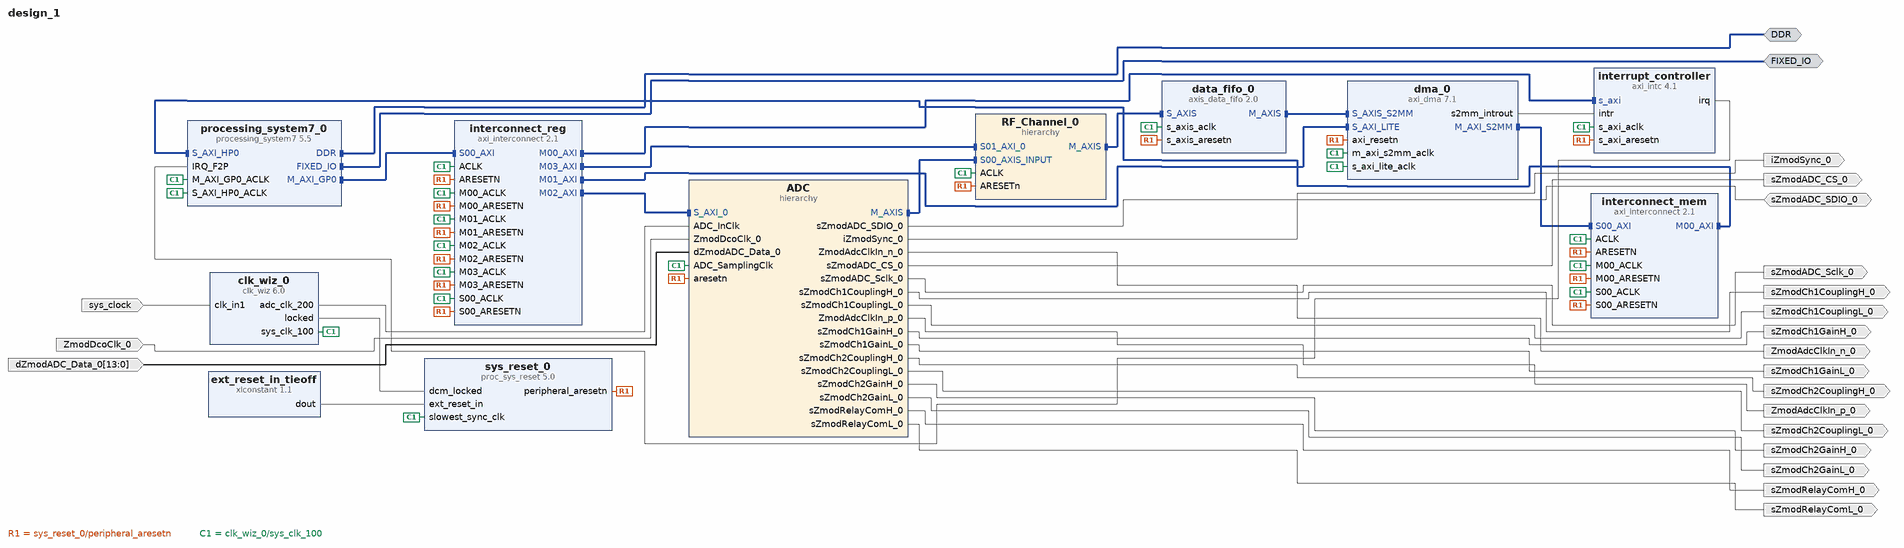
[diagram p0: block diagram of the top level]
# Vivado block design design_1, xc7z020clg484-1, Vivado 2023.1
create_bd_design design_1

create_bd_intf_port -mode Master -vlnv xilinx.com:interface:ddrx_rtl:1.0 DDR
create_bd_intf_port -mode Master -vlnv xilinx.com:display_processing_system7:fixedio_rtl:1.0 FIXED_IO
create_bd_port -dir O sZmodRelayComL_0
create_bd_port -dir O sZmodRelayComH_0
create_bd_port -dir O sZmodCh2GainL_0
create_bd_port -dir O sZmodCh2GainH_0
create_bd_port -dir O sZmodCh1GainL_0
create_bd_port -dir O sZmodCh1GainH_0
create_bd_port -dir O sZmodCh2CouplingL_0
create_bd_port -dir O sZmodCh2CouplingH_0
create_bd_port -dir O sZmodCh1CouplingL_0
create_bd_port -dir O sZmodCh1CouplingH_0
create_bd_port -dir O sZmodADC_Sclk_0
create_bd_port -dir O sZmodADC_CS_0
create_bd_port -dir IO sZmodADC_SDIO_0
create_bd_port -dir O iZmodSync_0
create_bd_port -dir O ZmodAdcClkIn_n_0
create_bd_port -dir O ZmodAdcClkIn_p_0
create_bd_port -dir I -from 13 -to 0 dZmodADC_Data_0
create_bd_port -dir I -type clk ZmodDcoClk_0
create_bd_port -dir I -type clk sys_clock
set_property -dict {CONFIG.FREQ_HZ 125000000 CONFIG.PHASE 0.0} [get_bd_ports sys_clock]

create_bd_cell -type ip -vlnv xilinx.com:ip:processing_system7:5.5 processing_system7_0
set_property -dict [list \
  CONFIG.PCW_APU_PERIPHERAL_FREQMHZ 666.666666 \
  CONFIG.PCW_ENET0_ENET0_IO {MIO 16 .. 27} \
  CONFIG.PCW_ENET0_GRP_MDIO_ENABLE 1 \
  CONFIG.PCW_ENET0_GRP_MDIO_IO {MIO 52 .. 53} \
  CONFIG.PCW_ENET0_PERIPHERAL_ENABLE 1 \
  CONFIG.PCW_ENET0_RESET_ENABLE 1 \
  CONFIG.PCW_ENET0_RESET_IO {MIO 9} \
  CONFIG.PCW_ENET_RESET_ENABLE 1 \
  CONFIG.PCW_ENET_RESET_SELECT {Share reset pin} \
  CONFIG.PCW_EN_CLK0_PORT 0 \
  CONFIG.PCW_FPGA0_PERIPHERAL_FREQMHZ 100 \
  CONFIG.PCW_FPGA1_PERIPHERAL_FREQMHZ 200 \
  CONFIG.PCW_GPIO_MIO_GPIO_ENABLE 1 \
  CONFIG.PCW_GPIO_MIO_GPIO_IO MIO \
  CONFIG.PCW_I2C1_I2C1_IO {MIO 12 .. 13} \
  CONFIG.PCW_I2C1_PERIPHERAL_ENABLE 1 \
  CONFIG.PCW_I2C_PERIPHERAL_FREQMHZ 111.111115 \
  CONFIG.PCW_I2C_RESET_ENABLE 1 \
  CONFIG.PCW_I2C_RESET_SELECT {Share reset pin} \
  CONFIG.PCW_IRQ_F2P_INTR 1 \
  CONFIG.PCW_PERIPHERAL_BOARD_PRESET part0 \
  CONFIG.PCW_PRESET_BANK1_VOLTAGE {LVCMOS 1.8V} \
  CONFIG.PCW_QSPI_GRP_FBCLK_ENABLE 1 \
  CONFIG.PCW_QSPI_GRP_FBCLK_IO {MIO 8} \
  CONFIG.PCW_QSPI_GRP_SINGLE_SS_ENABLE 1 \
  CONFIG.PCW_QSPI_GRP_SINGLE_SS_IO {MIO 1 .. 6} \
  CONFIG.PCW_QSPI_PERIPHERAL_ENABLE 1 \
  CONFIG.PCW_QSPI_QSPI_IO {MIO 1 .. 6} \
  CONFIG.PCW_SD0_GRP_CD_ENABLE 1 \
  CONFIG.PCW_SD0_GRP_CD_IO {MIO 47} \
  CONFIG.PCW_SD0_GRP_WP_ENABLE 0 \
  CONFIG.PCW_SD0_PERIPHERAL_ENABLE 1 \
  CONFIG.PCW_SD0_SD0_IO {MIO 40 .. 45} \
  CONFIG.PCW_SDIO_PERIPHERAL_FREQMHZ 50 \
  CONFIG.PCW_SINGLE_QSPI_DATA_MODE x4 \
  CONFIG.PCW_UART0_PERIPHERAL_ENABLE 1 \
  CONFIG.PCW_UART0_UART0_IO {MIO 14 .. 15} \
  CONFIG.PCW_UART1_PERIPHERAL_ENABLE 0 \
  CONFIG.PCW_UART_PERIPHERAL_FREQMHZ 100 \
  CONFIG.PCW_UIPARAM_DDR_FREQ_MHZ 533.333333 \
  CONFIG.PCW_UIPARAM_DDR_MEMORY_TYPE {DDR 3 (Low Voltage)} \
  CONFIG.PCW_UIPARAM_DDR_PARTNO {MT41K256M16 RE-125} \
  CONFIG.PCW_USB0_PERIPHERAL_ENABLE 1 \
  CONFIG.PCW_USB0_RESET_ENABLE 1 \
  CONFIG.PCW_USB0_RESET_IO {MIO 46} \
  CONFIG.PCW_USB0_USB0_IO {MIO 28 .. 39} \
  CONFIG.PCW_USB_RESET_ENABLE 1 \
  CONFIG.PCW_USB_RESET_SELECT {Share reset pin} \
  CONFIG.PCW_USE_FABRIC_INTERRUPT 1 \
  CONFIG.PCW_USE_S_AXI_HP0 1 \
  CONFIG.preset None \
] [get_bd_cells processing_system7_0]
# 512 more settings of processing_system7_0 are not shown: defaults, MIO pin electricals, DDR timing, and values the tool derives
create_bd_cell -type ip -vlnv xilinx.com:ip:clk_wiz:6.0 clk_wiz_0
set_property -dict [list \
  CONFIG.CLKOUT2_JITTER 109.241 \
  CONFIG.CLKOUT2_PHASE_ERROR 96.948 \
  CONFIG.CLKOUT2_REQUESTED_OUT_FREQ 200.000 \
  CONFIG.CLKOUT2_USED true \
  CONFIG.CLK_IN1_BOARD_INTERFACE sys_clock \
  CONFIG.CLK_OUT1_PORT sys_clk_100 \
  CONFIG.CLK_OUT2_PORT adc_clk_200 \
  CONFIG.MMCM_CLKOUT1_DIVIDE 5 \
  CONFIG.NUM_OUT_CLKS 2 \
  CONFIG.USE_BOARD_FLOW true \
] [get_bd_cells clk_wiz_0]
create_bd_cell -type ip -vlnv xilinx.com:ip:axi_interconnect:2.1 interconnect_reg
set_property -dict [list \
  CONFIG.ENABLE_ADVANCED_OPTIONS 1 \
  CONFIG.NUM_MI 4 \
  CONFIG.NUM_SI 1 \
  CONFIG.S00_HAS_REGSLICE 3 \
] [get_bd_cells interconnect_reg]
create_bd_cell -type ip -vlnv xilinx.com:ip:proc_sys_reset:5.0 sys_reset_0
set_property -dict {CONFIG.C_EXT_RST_WIDTH 1} [get_bd_cells sys_reset_0]
create_bd_cell -type ip -vlnv xilinx.com:ip:xlconstant:1.1 ext_reset_in_tieoff
create_bd_cell -type ip -vlnv xilinx.com:ip:axi_dma:7.1 dma_0
set_property -dict [list \
  CONFIG.c_include_mm2s 0 \
  CONFIG.c_include_s2mm 1 \
  CONFIG.c_include_sg 0 \
  CONFIG.c_m_axi_s2mm_data_width 64 \
] [get_bd_cells dma_0]
create_bd_cell -type ip -vlnv xilinx.com:ip:axi_interconnect:2.1 interconnect_mem
set_property -dict [list \
  CONFIG.ENABLE_ADVANCED_OPTIONS 1 \
  CONFIG.NUM_MI 1 \
  CONFIG.S00_HAS_REGSLICE 3 \
  CONFIG.XBAR_DATA_WIDTH 64 \
] [get_bd_cells interconnect_mem]
create_bd_cell -type ip -vlnv xilinx.com:ip:axis_data_fifo:2.0 data_fifo_0
set_property -dict [list \
  CONFIG.FIFO_DEPTH 512 \
  CONFIG.FIFO_MEMORY_TYPE auto \
  CONFIG.FIFO_MODE 2 \
  CONFIG.HAS_WR_DATA_COUNT 0 \
] [get_bd_cells data_fifo_0]
create_bd_cell -type ip -vlnv xilinx.com:ip:axi_intc:4.1 interrupt_controller
set_property -dict {CONFIG.C_IRQ_CONNECTION 1 CONFIG.C_KIND_OF_INTR 0xFFFFFFFF} [get_bd_cells interrupt_controller]
create_bd_cell -type hier RF_Channel_0
create_bd_cell -type hier ADC

# ---- hierarchy /RF_Channel_0 ----
current_bd_instance /RF_Channel_0
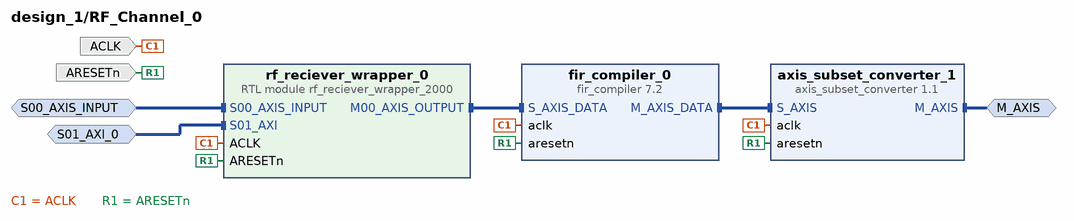
[diagram p1: block diagram inside /RF_Channel_0]
create_bd_intf_pin -mode Slave -vlnv xilinx.com:interface:axis_rtl:1.0 S00_AXIS_INPUT
create_bd_intf_pin -mode Master -vlnv xilinx.com:interface:axis_rtl:1.0 M_AXIS
create_bd_intf_pin -mode Slave -vlnv xilinx.com:interface:aximm_rtl:1.0 S01_AXI_0
create_bd_pin -dir I -type rst ARESETn
create_bd_pin -dir I -type clk ACLK

create_bd_cell -type ip -vlnv xilinx.com:ip:fir_compiler:7.2 fir_compiler_0
set_property -dict [list \
  CONFIG.BestPrecision false \
  CONFIG.Channel_Sequence Basic \
  CONFIG.Clock_Frequency 300.0 \
  CONFIG.CoefficientSource COE_File \
  CONFIG.Coefficient_File ../../../../../utils_1/fir_decimation_x16.coe \
  CONFIG.Coefficient_Fractional_Bits 0 \
  CONFIG.Coefficient_Reload false \
  CONFIG.Coefficient_Sets 1 \
  CONFIG.Coefficient_Sign Signed \
  CONFIG.Coefficient_Structure Inferred \
  CONFIG.Coefficient_Width 24 \
  CONFIG.ColumnConfig 1 \
  CONFIG.DATA_Has_TLAST Not_Required \
  CONFIG.Data_Fractional_Bits 0 \
  CONFIG.Data_Width 16 \
  CONFIG.Decimation_Rate 16 \
  CONFIG.Filter_Architecture Systolic_Multiply_Accumulate \
  CONFIG.Filter_Selection 1 \
  CONFIG.Filter_Type Decimation \
  CONFIG.Has_ARESETn true \
  CONFIG.Interpolation_Rate 1 \
  CONFIG.M_DATA_Has_TUSER Not_Required \
  CONFIG.Number_Channels 1 \
  CONFIG.Number_Paths 2 \
  CONFIG.Output_Rounding_Mode Truncate_LSBs \
  CONFIG.Output_Width 17 \
  CONFIG.Passband_Max 0.35 \
  CONFIG.Quantization Integer_Coefficients \
  CONFIG.RateSpecification Input_Sample_Period \
  CONFIG.S_DATA_Has_FIFO false \
  CONFIG.S_DATA_Has_TUSER Not_Required \
  CONFIG.SamplePeriod 32 \
  CONFIG.Sample_Frequency 0.001 \
  CONFIG.Select_Pattern All \
  CONFIG.Zero_Pack_Factor 1 \
] [get_bd_cells fir_compiler_0]
create_bd_cell -type ip -vlnv xilinx.com:ip:axis_subset_converter:1.1 axis_subset_converter_1
set_property -dict [list \
  CONFIG.DEFAULT_TLAST 256 \
  CONFIG.M_HAS_TLAST 1 \
  CONFIG.M_TDATA_NUM_BYTES 4 \
  CONFIG.TDATA_REMAP {tdata[39:24], tdata[15:0]} \
] [get_bd_cells axis_subset_converter_1]
create_bd_cell -type module -reference rf_reciever_wrapper_2000 rf_reciever_wrapper_0
set_property -dict [list \
  CONFIG.G_CIC_DECIMATION 32 \
  CONFIG.G_CIC_ORDER 8 \
  CONFIG.G_HAS_SECOND_OUTPUT true \
  CONFIG.G_S01_AXI_ADDR_WIDTH 8 \
] [get_bd_cells rf_reciever_wrapper_0]

# ---- hierarchy /ADC ----
current_bd_instance /ADC
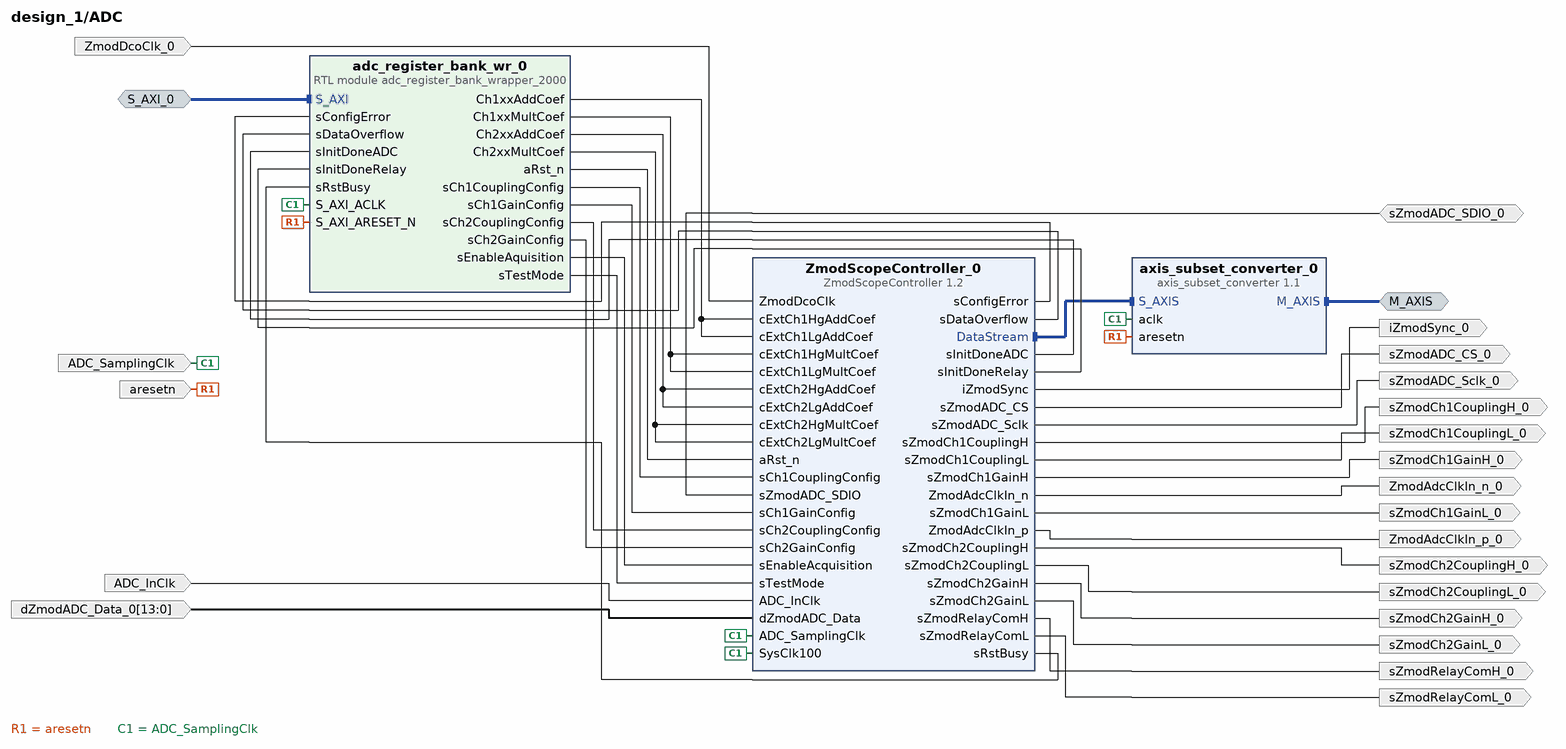
[diagram p2: block diagram inside /ADC]
create_bd_intf_pin -mode Master -vlnv xilinx.com:interface:axis_rtl:1.0 M_AXIS
create_bd_intf_pin -mode Slave -vlnv xilinx.com:interface:aximm_rtl:1.0 S_AXI_0
create_bd_pin -dir I -type clk ADC_SamplingClk
create_bd_pin -dir I -type clk ADC_InClk
create_bd_pin -dir I -type rst aresetn
create_bd_pin -dir O ZmodAdcClkIn_p_0
create_bd_pin -dir O ZmodAdcClkIn_n_0
create_bd_pin -dir O iZmodSync_0
create_bd_pin -dir I -type clk ZmodDcoClk_0
create_bd_pin -dir I -from 13 -to 0 dZmodADC_Data_0
create_bd_pin -dir IO sZmodADC_SDIO_0
create_bd_pin -dir O sZmodADC_CS_0
create_bd_pin -dir O sZmodADC_Sclk_0
create_bd_pin -dir O sZmodCh1CouplingH_0
create_bd_pin -dir O sZmodCh1CouplingL_0
create_bd_pin -dir O sZmodCh2CouplingH_0
create_bd_pin -dir O sZmodCh2CouplingL_0
create_bd_pin -dir O sZmodCh1GainH_0
create_bd_pin -dir O sZmodCh1GainL_0
create_bd_pin -dir O sZmodCh2GainH_0
create_bd_pin -dir O sZmodCh2GainL_0
create_bd_pin -dir O sZmodRelayComH_0
create_bd_pin -dir O sZmodRelayComL_0

create_bd_cell -type ip -vlnv digilent.com:user:ZmodScopeController:1.2 ZmodScopeController_0
set_property -dict [list \
  CONFIG.kADC_ClkDiv 2 \
  CONFIG.kCh1CouplingStatic {"1"} \
  CONFIG.kCh1GainStatic {"1"} \
  CONFIG.kCh2CouplingStatic {"1"} \
  CONFIG.kCh2GainStatic {"1"} \
  CONFIG.kExtCalibEn true \
  CONFIG.kExtRelayConfigEn true \
  CONFIG.kExtSyncEn false \
] [get_bd_cells ZmodScopeController_0]
create_bd_cell -type ip -vlnv xilinx.com:ip:axis_subset_converter:1.1 axis_subset_converter_0
set_property -dict {CONFIG.M_TDATA_NUM_BYTES 2 CONFIG.TDATA_REMAP {tdata[31:16]}} [get_bd_cells axis_subset_converter_0]
create_bd_cell -type module -reference adc_register_bank_wrapper_2000 adc_register_bank_wr_0

# ---- connections ----

current_bd_instance /RF_Channel_0
connect_bd_intf_net [get_bd_intf_pins rf_reciever_wrapper_0/S00_AXIS_INPUT] [get_bd_intf_pins S00_AXIS_INPUT]
connect_bd_intf_net [get_bd_intf_pins axis_subset_converter_1/M_AXIS] [get_bd_intf_pins M_AXIS]
connect_bd_intf_net [get_bd_intf_pins rf_reciever_wrapper_0/S01_AXI] [get_bd_intf_pins S01_AXI_0]
connect_bd_intf_net [get_bd_intf_pins fir_compiler_0/M_AXIS_DATA] [get_bd_intf_pins axis_subset_converter_1/S_AXIS]
connect_bd_intf_net [get_bd_intf_pins fir_compiler_0/S_AXIS_DATA] [get_bd_intf_pins rf_reciever_wrapper_0/M00_AXIS_OUTPUT]
connect_bd_net [get_bd_pins ACLK] \
  [get_bd_pins axis_subset_converter_1/aclk] [get_bd_pins fir_compiler_0/aclk] [get_bd_pins rf_reciever_wrapper_0/ACLK]
connect_bd_net [get_bd_pins ARESETn] \
  [get_bd_pins axis_subset_converter_1/aresetn] [get_bd_pins fir_compiler_0/aresetn] \
  [get_bd_pins rf_reciever_wrapper_0/ARESETn]

current_bd_instance /ADC
connect_bd_intf_net [get_bd_intf_pins adc_register_bank_wr_0/S_AXI] [get_bd_intf_pins S_AXI_0]
connect_bd_intf_net [get_bd_intf_pins ZmodScopeController_0/DataStream] [get_bd_intf_pins axis_subset_converter_0/S_AXIS]
connect_bd_intf_net [get_bd_intf_pins M_AXIS] [get_bd_intf_pins axis_subset_converter_0/M_AXIS]
connect_bd_net [get_bd_pins sZmodADC_SDIO_0] [get_bd_pins ZmodScopeController_0/sZmodADC_SDIO]
connect_bd_net -net ZmodDcoClk_0_1 [get_bd_pins ZmodDcoClk_0] [get_bd_pins ZmodScopeController_0/ZmodDcoClk]
connect_bd_net [get_bd_pins ZmodScopeController_0/ZmodAdcClkIn_n] [get_bd_pins ZmodAdcClkIn_n_0]
connect_bd_net [get_bd_pins ZmodScopeController_0/ZmodAdcClkIn_p] [get_bd_pins ZmodAdcClkIn_p_0]
connect_bd_net [get_bd_pins ZmodScopeController_0/iZmodSync] [get_bd_pins iZmodSync_0]
connect_bd_net [get_bd_pins ZmodScopeController_0/sConfigError] [get_bd_pins adc_register_bank_wr_0/sConfigError]
connect_bd_net [get_bd_pins ZmodScopeController_0/sDataOverflow] [get_bd_pins adc_register_bank_wr_0/sDataOverflow]
connect_bd_net [get_bd_pins ZmodScopeController_0/sInitDoneADC] [get_bd_pins adc_register_bank_wr_0/sInitDoneADC]
connect_bd_net [get_bd_pins ZmodScopeController_0/sInitDoneRelay] [get_bd_pins adc_register_bank_wr_0/sInitDoneRelay]
connect_bd_net [get_bd_pins ZmodScopeController_0/sRstBusy] [get_bd_pins adc_register_bank_wr_0/sRstBusy]
connect_bd_net [get_bd_pins ZmodScopeController_0/sZmodADC_CS] [get_bd_pins sZmodADC_CS_0]
connect_bd_net [get_bd_pins ZmodScopeController_0/sZmodADC_Sclk] [get_bd_pins sZmodADC_Sclk_0]
connect_bd_net [get_bd_pins ZmodScopeController_0/sZmodCh1CouplingH] [get_bd_pins sZmodCh1CouplingH_0]
connect_bd_net [get_bd_pins ZmodScopeController_0/sZmodCh1CouplingL] [get_bd_pins sZmodCh1CouplingL_0]
connect_bd_net [get_bd_pins ZmodScopeController_0/sZmodCh1GainH] [get_bd_pins sZmodCh1GainH_0]
connect_bd_net [get_bd_pins ZmodScopeController_0/sZmodCh1GainL] [get_bd_pins sZmodCh1GainL_0]
connect_bd_net [get_bd_pins ZmodScopeController_0/sZmodCh2CouplingH] [get_bd_pins sZmodCh2CouplingH_0]
connect_bd_net [get_bd_pins ZmodScopeController_0/sZmodCh2CouplingL] [get_bd_pins sZmodCh2CouplingL_0]
connect_bd_net [get_bd_pins ZmodScopeController_0/sZmodCh2GainH] [get_bd_pins sZmodCh2GainH_0]
connect_bd_net [get_bd_pins ZmodScopeController_0/sZmodCh2GainL] [get_bd_pins sZmodCh2GainL_0]
connect_bd_net [get_bd_pins ZmodScopeController_0/sZmodRelayComH] [get_bd_pins sZmodRelayComH_0]
connect_bd_net [get_bd_pins ZmodScopeController_0/sZmodRelayComL] [get_bd_pins sZmodRelayComL_0]
connect_bd_net [get_bd_pins adc_register_bank_wr_0/Ch1xxAddCoef] \
  [get_bd_pins ZmodScopeController_0/cExtCh1LgAddCoef] [get_bd_pins ZmodScopeController_0/cExtCh1HgAddCoef]
connect_bd_net [get_bd_pins adc_register_bank_wr_0/Ch1xxMultCoef] \
  [get_bd_pins ZmodScopeController_0/cExtCh1HgMultCoef] [get_bd_pins ZmodScopeController_0/cExtCh1LgMultCoef]
connect_bd_net [get_bd_pins adc_register_bank_wr_0/Ch2xxAddCoef] \
  [get_bd_pins ZmodScopeController_0/cExtCh2LgAddCoef] [get_bd_pins ZmodScopeController_0/cExtCh2HgAddCoef]
connect_bd_net [get_bd_pins adc_register_bank_wr_0/Ch2xxMultCoef] \
  [get_bd_pins ZmodScopeController_0/cExtCh2HgMultCoef] [get_bd_pins ZmodScopeController_0/cExtCh2LgMultCoef]
connect_bd_net [get_bd_pins adc_register_bank_wr_0/aRst_n] [get_bd_pins ZmodScopeController_0/aRst_n]
connect_bd_net [get_bd_pins adc_register_bank_wr_0/sCh1CouplingConfig] [get_bd_pins ZmodScopeController_0/sCh1CouplingConfig]
connect_bd_net [get_bd_pins adc_register_bank_wr_0/sCh1GainConfig] [get_bd_pins ZmodScopeController_0/sCh1GainConfig]
connect_bd_net [get_bd_pins adc_register_bank_wr_0/sCh2CouplingConfig] [get_bd_pins ZmodScopeController_0/sCh2CouplingConfig]
connect_bd_net [get_bd_pins adc_register_bank_wr_0/sCh2GainConfig] [get_bd_pins ZmodScopeController_0/sCh2GainConfig]
connect_bd_net [get_bd_pins adc_register_bank_wr_0/sEnableAquisition] [get_bd_pins ZmodScopeController_0/sEnableAcquisition]
connect_bd_net [get_bd_pins adc_register_bank_wr_0/sTestMode] [get_bd_pins ZmodScopeController_0/sTestMode]
connect_bd_net -net clk_wiz_0_adc_clk_200 [get_bd_pins ADC_InClk] [get_bd_pins ZmodScopeController_0/ADC_InClk]
connect_bd_net -net clk_wiz_0_locked [get_bd_pins aresetn] \
  [get_bd_pins axis_subset_converter_0/aresetn] [get_bd_pins adc_register_bank_wr_0/S_AXI_ARESET_N]
connect_bd_net -net clk_wiz_0_sys_clk_100 [get_bd_pins ADC_SamplingClk] \
  [get_bd_pins ZmodScopeController_0/ADC_SamplingClk] [get_bd_pins axis_subset_converter_0/aclk] \
  [get_bd_pins ZmodScopeController_0/SysClk100] [get_bd_pins adc_register_bank_wr_0/S_AXI_ACLK]
connect_bd_net -net dZmodADC_Data_0_1 [get_bd_pins dZmodADC_Data_0] [get_bd_pins ZmodScopeController_0/dZmodADC_Data]

current_bd_instance /
connect_bd_intf_net [get_bd_intf_pins data_fifo_0/S_AXIS] [get_bd_intf_pins RF_Channel_0/M_AXIS]
connect_bd_intf_net [get_bd_intf_pins interconnect_reg/S00_AXI] [get_bd_intf_pins processing_system7_0/M_AXI_GP0]
connect_bd_intf_net -intf_net S_AXI_0_1 [get_bd_intf_pins ADC/S_AXI_0] [get_bd_intf_pins interconnect_reg/M02_AXI]
connect_bd_intf_net -intf_net axi_dma_0_M_AXI_S2MM [get_bd_intf_pins dma_0/M_AXI_S2MM] [get_bd_intf_pins interconnect_mem/S00_AXI]
connect_bd_intf_net -intf_net axi_interconnect_1_M00_AXI [get_bd_intf_pins interconnect_mem/M00_AXI] [get_bd_intf_pins processing_system7_0/S_AXI_HP0]
connect_bd_intf_net -intf_net axis_data_fifo_0_M_AXIS [get_bd_intf_pins data_fifo_0/M_AXIS] [get_bd_intf_pins dma_0/S_AXIS_S2MM]
connect_bd_intf_net -intf_net axis_subset_converter_0_M_AXIS [get_bd_intf_pins ADC/M_AXIS] [get_bd_intf_pins RF_Channel_0/S00_AXIS_INPUT]
connect_bd_intf_net [get_bd_intf_pins interrupt_controller/s_axi] [get_bd_intf_pins interconnect_reg/M00_AXI]
connect_bd_intf_net [get_bd_intf_pins interconnect_reg/M01_AXI] [get_bd_intf_pins dma_0/S_AXI_LITE]
connect_bd_intf_net [get_bd_intf_pins interconnect_reg/M03_AXI] [get_bd_intf_pins RF_Channel_0/S01_AXI_0]
connect_bd_intf_net [get_bd_intf_ports DDR] [get_bd_intf_pins processing_system7_0/DDR]
connect_bd_intf_net [get_bd_intf_ports FIXED_IO] [get_bd_intf_pins processing_system7_0/FIXED_IO]
connect_bd_net [get_bd_ports sZmodADC_SDIO_0] [get_bd_pins ADC/sZmodADC_SDIO_0]
connect_bd_net -net ZmodDcoClk_0_1 [get_bd_ports ZmodDcoClk_0] [get_bd_pins ADC/ZmodDcoClk_0]
connect_bd_net -net ZmodScopeController_0_ZmodAdcClkIn_n [get_bd_pins ADC/ZmodAdcClkIn_n_0] [get_bd_ports ZmodAdcClkIn_n_0]
connect_bd_net -net ZmodScopeController_0_ZmodAdcClkIn_p [get_bd_pins ADC/ZmodAdcClkIn_p_0] [get_bd_ports ZmodAdcClkIn_p_0]
connect_bd_net -net ZmodScopeController_0_iZmodSync [get_bd_pins ADC/iZmodSync_0] [get_bd_ports iZmodSync_0]
connect_bd_net -net ZmodScopeController_0_sZmodADC_CS [get_bd_pins ADC/sZmodADC_CS_0] [get_bd_ports sZmodADC_CS_0]
connect_bd_net -net ZmodScopeController_0_sZmodADC_Sclk [get_bd_pins ADC/sZmodADC_Sclk_0] [get_bd_ports sZmodADC_Sclk_0]
connect_bd_net -net ZmodScopeController_0_sZmodCh1CouplingH [get_bd_pins ADC/sZmodCh1CouplingH_0] [get_bd_ports sZmodCh1CouplingH_0]
connect_bd_net -net ZmodScopeController_0_sZmodCh1CouplingL [get_bd_pins ADC/sZmodCh1CouplingL_0] [get_bd_ports sZmodCh1CouplingL_0]
connect_bd_net -net ZmodScopeController_0_sZmodCh1GainH [get_bd_pins ADC/sZmodCh1GainH_0] [get_bd_ports sZmodCh1GainH_0]
connect_bd_net -net ZmodScopeController_0_sZmodCh1GainL [get_bd_pins ADC/sZmodCh1GainL_0] [get_bd_ports sZmodCh1GainL_0]
connect_bd_net -net ZmodScopeController_0_sZmodCh2CouplingH [get_bd_pins ADC/sZmodCh2CouplingH_0] [get_bd_ports sZmodCh2CouplingH_0]
connect_bd_net -net ZmodScopeController_0_sZmodCh2CouplingL [get_bd_pins ADC/sZmodCh2CouplingL_0] [get_bd_ports sZmodCh2CouplingL_0]
connect_bd_net -net ZmodScopeController_0_sZmodCh2GainH [get_bd_pins ADC/sZmodCh2GainH_0] [get_bd_ports sZmodCh2GainH_0]
connect_bd_net -net ZmodScopeController_0_sZmodCh2GainL [get_bd_pins ADC/sZmodCh2GainL_0] [get_bd_ports sZmodCh2GainL_0]
connect_bd_net -net ZmodScopeController_0_sZmodRelayComH [get_bd_pins ADC/sZmodRelayComH_0] [get_bd_ports sZmodRelayComH_0]
connect_bd_net -net ZmodScopeController_0_sZmodRelayComL [get_bd_pins ADC/sZmodRelayComL_0] [get_bd_ports sZmodRelayComL_0]
connect_bd_net [get_bd_pins clk_wiz_0/adc_clk_200] [get_bd_pins ADC/ADC_InClk]
connect_bd_net -net clk_wiz_0_locked [get_bd_pins sys_reset_0/peripheral_aresetn] \
  [get_bd_pins interconnect_reg/M00_ARESETN] [get_bd_pins dma_0/axi_resetn] [get_bd_pins interconnect_mem/M00_ARESETN] \
  [get_bd_pins interconnect_mem/S00_ARESETN] [get_bd_pins interconnect_mem/ARESETN] \
  [get_bd_pins interconnect_reg/S00_ARESETN] [get_bd_pins interconnect_reg/ARESETN] [get_bd_pins data_fifo_0/s_axis_aresetn] \
  [get_bd_pins interconnect_reg/M01_ARESETN] [get_bd_pins interrupt_controller/s_axi_aresetn] \
  [get_bd_pins RF_Channel_0/ARESETn] [get_bd_pins ADC/aresetn] [get_bd_pins interconnect_reg/M02_ARESETN] \
  [get_bd_pins interconnect_reg/M03_ARESETN]
connect_bd_net [get_bd_pins clk_wiz_0/locked] [get_bd_pins sys_reset_0/dcm_locked]
connect_bd_net [get_bd_pins clk_wiz_0/sys_clk_100] \
  [get_bd_pins interconnect_reg/M00_ACLK] [get_bd_pins sys_reset_0/slowest_sync_clk] [get_bd_pins dma_0/m_axi_s2mm_aclk] \
  [get_bd_pins dma_0/s_axi_lite_aclk] [get_bd_pins interconnect_mem/ACLK] [get_bd_pins interconnect_mem/M00_ACLK] \
  [get_bd_pins interconnect_mem/S00_ACLK] [get_bd_pins interconnect_reg/S00_ACLK] [get_bd_pins interconnect_reg/ACLK] \
  [get_bd_pins processing_system7_0/S_AXI_HP0_ACLK] [get_bd_pins processing_system7_0/M_AXI_GP0_ACLK] \
  [get_bd_pins data_fifo_0/s_axis_aclk] [get_bd_pins interconnect_reg/M01_ACLK] [get_bd_pins interrupt_controller/s_axi_aclk] \
  [get_bd_pins RF_Channel_0/ACLK] [get_bd_pins ADC/ADC_SamplingClk] [get_bd_pins interconnect_reg/M02_ACLK] \
  [get_bd_pins interconnect_reg/M03_ACLK]
connect_bd_net -net dZmodADC_Data_0_1 [get_bd_ports dZmodADC_Data_0] [get_bd_pins ADC/dZmodADC_Data_0]
connect_bd_net [get_bd_pins dma_0/s2mm_introut] [get_bd_pins interrupt_controller/intr]
connect_bd_net [get_bd_pins interrupt_controller/irq] [get_bd_pins processing_system7_0/IRQ_F2P]
connect_bd_net [get_bd_ports sys_clock] [get_bd_pins clk_wiz_0/clk_in1]
connect_bd_net -net xlconstant_8_dout [get_bd_pins ext_reset_in_tieoff/dout] [get_bd_pins sys_reset_0/ext_reset_in]

# ---- address map ----
assign_bd_address -offset 0x00000000 -range 1G -target_address_space [get_bd_addr_spaces dma_0/Data_S2MM] [get_bd_addr_segs processing_system7_0/S_AXI_HP0/HP0_DDR_LOWOCM]
assign_bd_address -offset 0x40000000 -range 4K -target_address_space [get_bd_addr_spaces processing_system7_0/Data] [get_bd_addr_segs ADC/adc_register_bank_wr_0/S_AXI/reg0]
assign_bd_address -offset 0x40001000 -range 4K -target_address_space [get_bd_addr_spaces processing_system7_0/Data] [get_bd_addr_segs RF_Channel_0/rf_reciever_wrapper_0/S01_AXI/reg0]
assign_bd_address -offset 0x40400000 -range 64K -target_address_space [get_bd_addr_spaces processing_system7_0/Data] [get_bd_addr_segs dma_0/S_AXI_LITE/Reg]
assign_bd_address -offset 0x41800000 -range 64K -target_address_space [get_bd_addr_spaces processing_system7_0/Data] [get_bd_addr_segs interrupt_controller/S_AXI/Reg]

validate_bd_design
save_bd_design
